# EAGLE design Temperature Card (EAGLE 6.4)

## Sheet 1 of 2
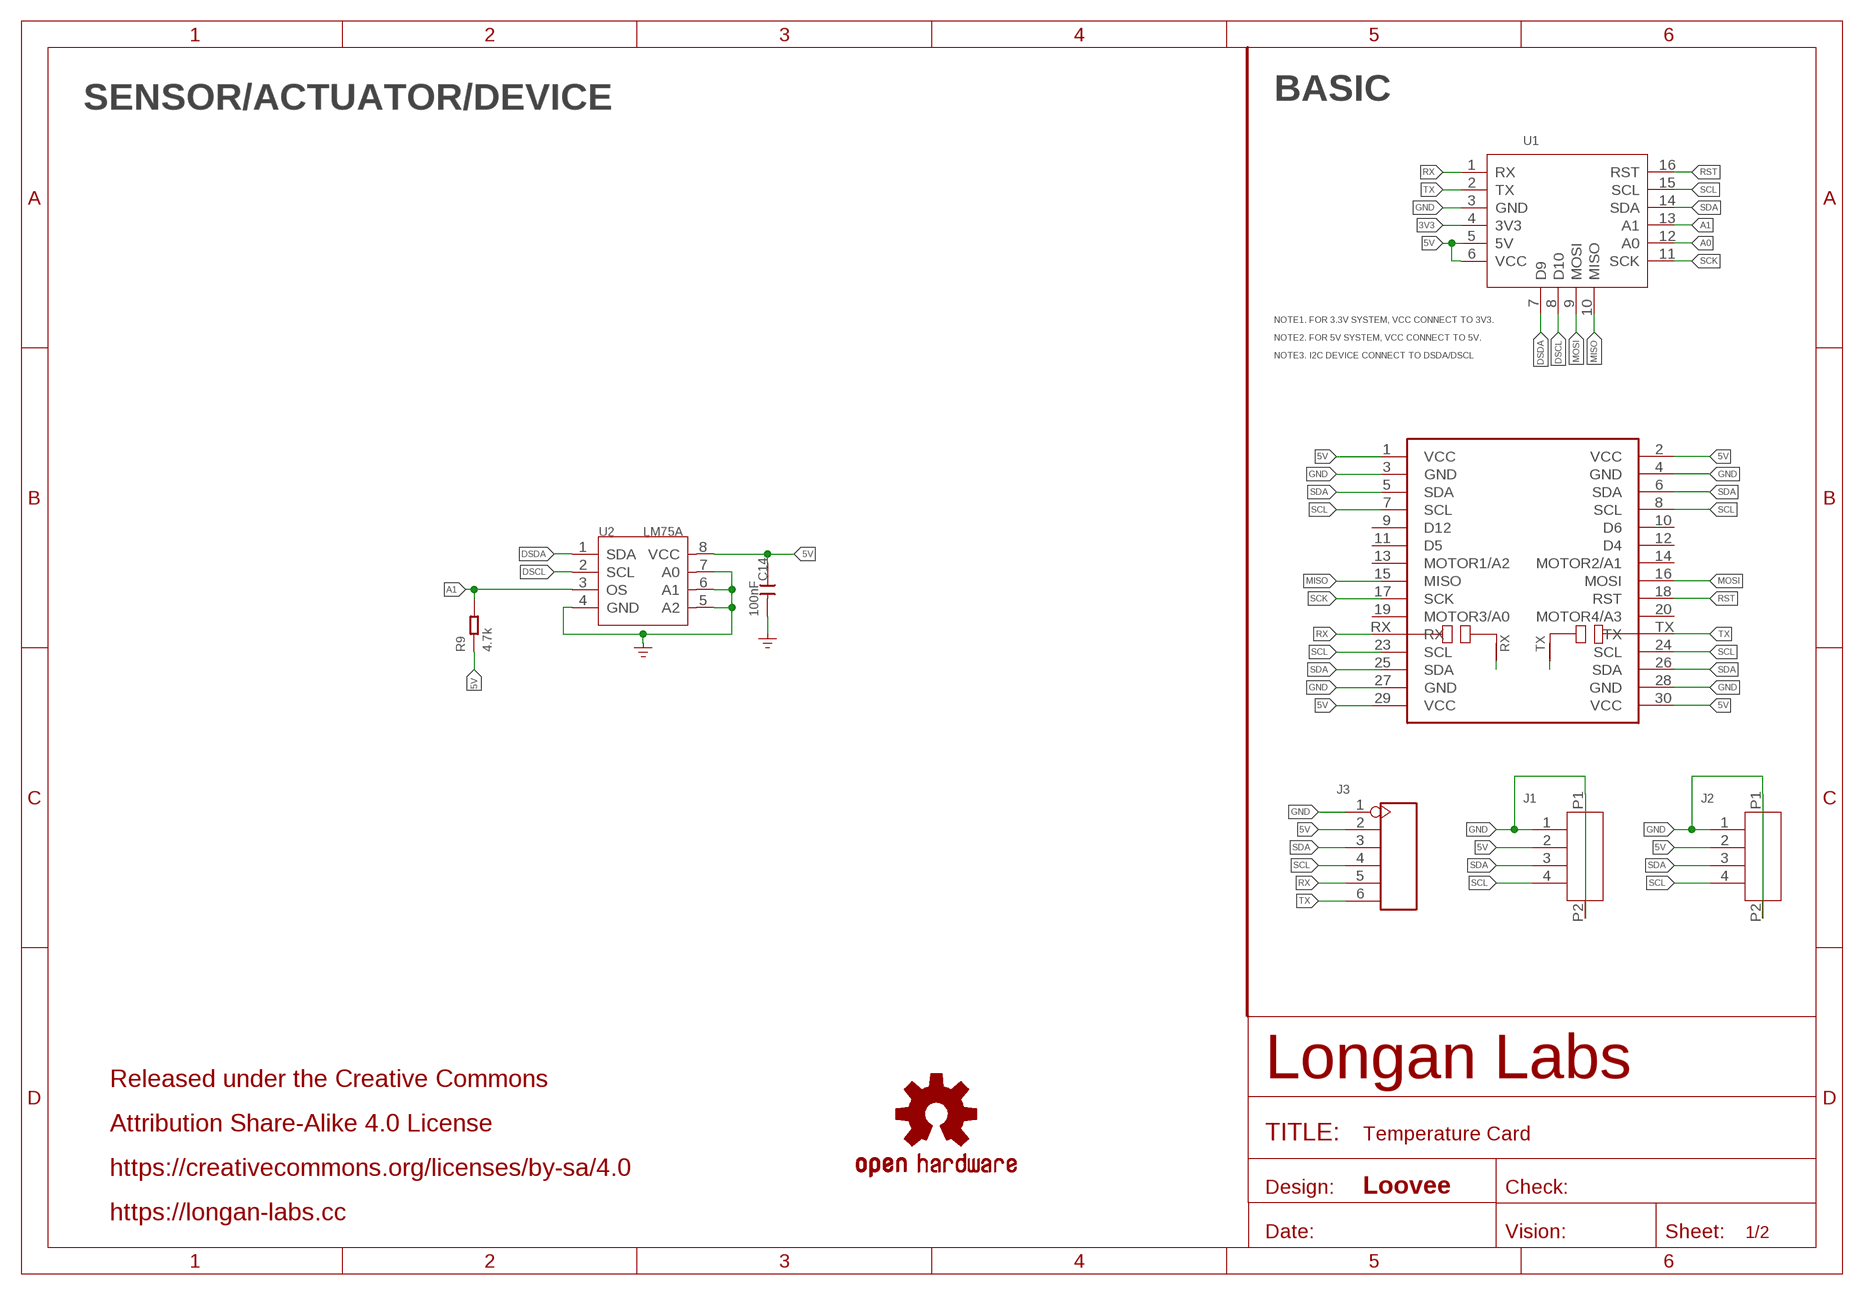
[diagram p0: schematic, sheet 1]

### Parts
C14  100nF  CAP-0603  [C0603]
J1  HEADER-4P-1.0  [4P-1.0-90D]
J2  HEADER-4P-1.0  [4P-1.0-90D]
J3  HEADER-6P-55/35MIL  [H6-2.54]
LOGO2  OSHW-LOGOS  [OSHW-LOGO-S]
MOUDLE2  MOUDLE-CARDS-UART'BOARD'  [MOUDLE-2X15P-UART]
R9  4.7k  RES-0603  [R0603]
U1  MOUDLE-CARDS  [16P-2.0-CARDS]
U2  LM75A  SENSOR-LM75A  [TSSOP8-0.65-3X3MM]

### Nets
3V3: U1.4(3V3)
5V: C14.1 J1.2 J2.2 J3.2 MOUDLE2.1(VCC) MOUDLE2.2(VCC) MOUDLE2.29(VCC) MOUDLE2.30(VCC) R9.1 U1.5(5V) U1.6(VCC) U2.8(VCC)
A0: U1.12(A0)
A1: R9.2 U1.13(A1) U2.3(OS)
DSCL: U1.8(D10) U2.2(SCL)
DSDA: U1.7(D9) U2.1(SDA)
GND: C14.2 J1.1 J1.P1 J1.P2 J2.1 J2.P1 J2.P2 J3.1 MOUDLE2.3(GND) MOUDLE2.4(GND) MOUDLE2.27(GND) MOUDLE2.28(GND) U1.3(GND) U2.4(GND) U2.5(A2) U2.6(A1) U2.7(A0) ; supply symbol labelled GND_POWER
MISO: MOUDLE2.15(MISO) U1.10(MISO)
MOSI: MOUDLE2.16(MOSI) U1.9(MOSI)
N$1: MOUDLE2.RX/N1(RX/N) MOUDLE2.RX/N2(RX/N)
N$2: MOUDLE2.TX/N1(TX/N) MOUDLE2.TX/N2(TX/N)
RST: MOUDLE2.18(RST) U1.16(RST)
RX: J3.5 MOUDLE2.RX U1.1(RX)
SCK: MOUDLE2.17(SCK) U1.11(SCK)
SCL: J1.4 J2.4 J3.4 MOUDLE2.7(SCL) MOUDLE2.8(SCL) MOUDLE2.23(SCL) MOUDLE2.24(SCL) U1.15(SCL)
SDA: J1.3 J2.3 J3.3 MOUDLE2.5(SDA) MOUDLE2.6(SDA) MOUDLE2.25(SDA) MOUDLE2.26(SDA) U1.14(SDA)
TX: J3.6 MOUDLE2.TX U1.2(TX)
Unconnected: MOUDLE2.9(D12) MOUDLE2.10(D6) MOUDLE2.11(D5) MOUDLE2.12(D4) MOUDLE2.13(MOTOR1/A2) MOUDLE2.14(MOTOR2/A1) MOUDLE2.19(MOTOR3/A0) MOUDLE2.20(MOTOR4/A3)

### Notes on the sheet
- SENSOR/ACTUATOR/DEVICE | BASIC
- NOTE1. FOR 3.3V SYSTEM, VCC CONNECT TO 3V3.
- NOTE2. FOR 5V SYSTEM, VCC CONNECT TO 5V.
- NOTE3. I2C DEVICE CONNECT TO DSDA/DSCL
- Released under the Creative Commons
- Attribution Share-Alike 4.0 License
- https://creativecommons.org/licenses/by-sa/4.0
- Loovee
- https://longan-labs.cc

## Sheet 2 of 2

## Library data of the parts
C14 = Discrete-new:CAP: Ceramic Capacitors
J1 J2 = Longan-Connect:HEADER-4P-1.0
J3 = Connector-new:HEADER-6P
LOGO2 = SparkFun-Aesthetics:OSHW-LOGO: Open-Source Hardware (OSHW) Logo This logo indicates the piece of hardware it is found on incorporates a OSHW license and/or adheres to the definition of open source hardware found here: http://freedomdefined.org/OSHW
MOUDLE2 = Longan-moudle:MOUDLE-CARDS-UART
R9 = Discrete-new:RES
U1 = MOUDLE-CARDS:MOUDLE-CARDS
U2 = Discrete-new:SENSOR-LM75A: E314010005

## Board
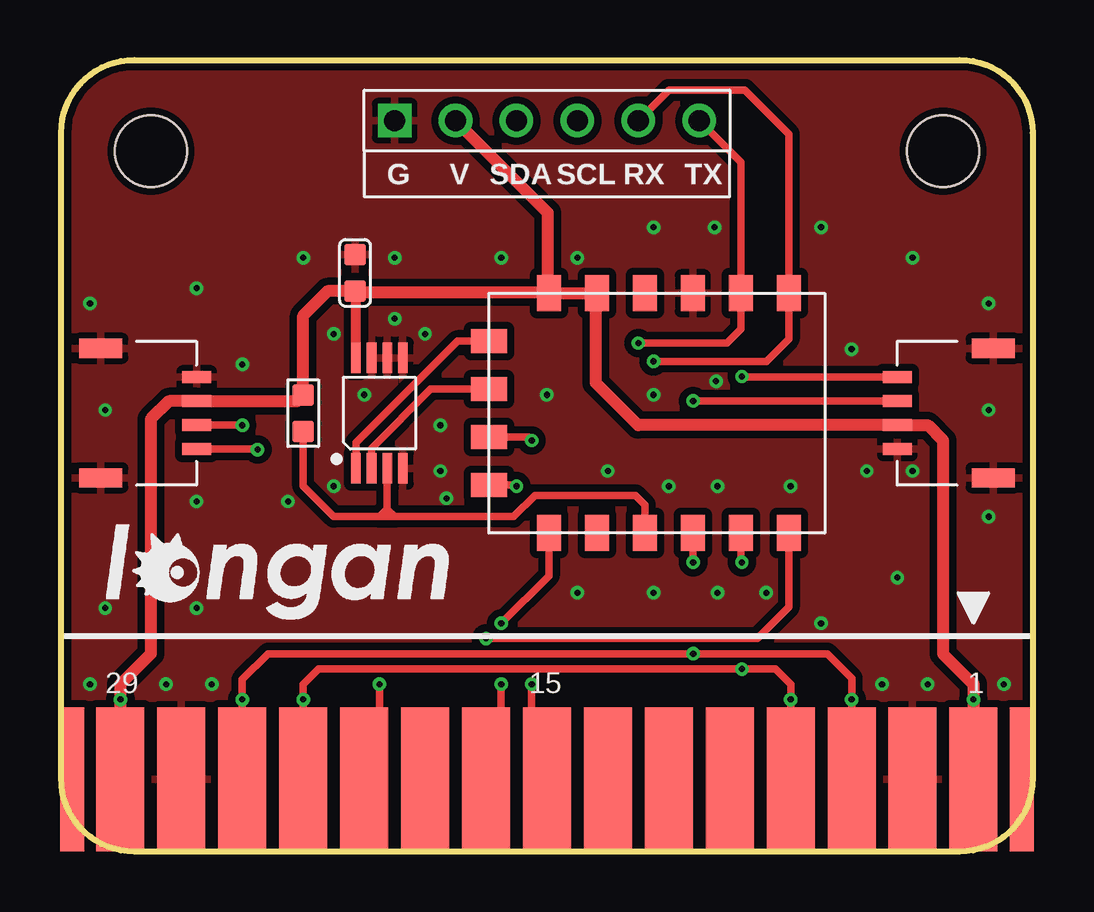
[diagram p1: board, top side]
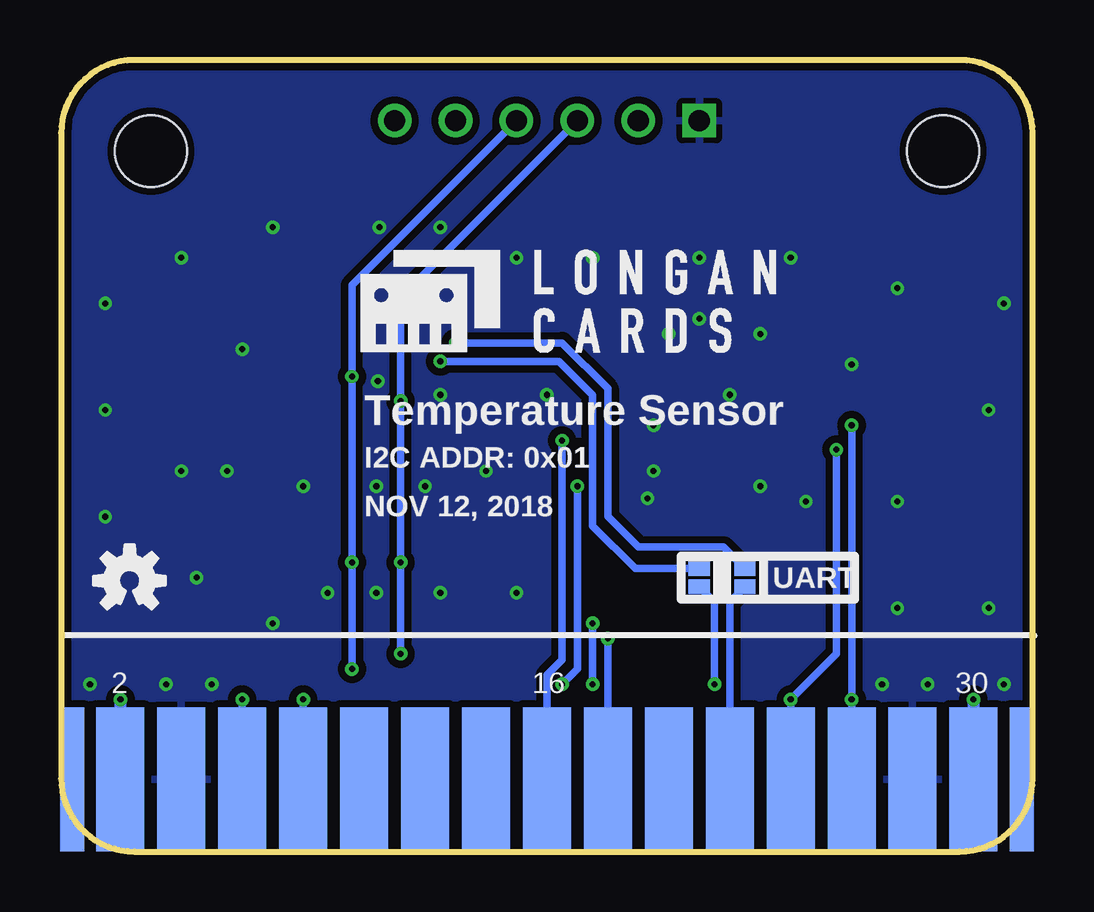
[diagram p2: board, bottom side, seen from below]

Size 40.5 x 33 mm. Coordinates in mm from the lower left corner, seen from the top.
Copper layers (1*16): Top 0.035mm / dielectric 1.5mm / Bottom 0.035mm
Design rules "SeeedStudio_2layer_DRU_no_angle_20140221 *": minimum track width 6mil, minimum drill 10mil, track to track 6mil, track to pad 6mil, pad to pad 6mil, via to via 6mil, smd to smd 0mil, copper to edge 10mil, drill to drill 10mil, minimum pad ring 10mil, minimum via ring 6mil, stop-mask expansion 2mil, vias tented up to drill 25mil, thermal gap 10mil

### Footprints (pad centres in the part's own frame; a part is rotated, then mirrored left to right if it is on the bottom)
C0603 = smd 0.889 x 0.889: 1 0,0.762; 2 0,-0.762
4P-1.0-90D = smd 1.2 x 0.5: 1 0,1.5; 2 0,0.5; 3 0,-0.5; 4 0,-1.5 | smd 1.8 x 0.8: P1 -4,2.7; P2 -4,-2.7
H6-2.54 = drill 0.889 pad 1.397 square: 1 0,6.35 | drill 0.889 pad 1.397: 2 0,3.81; 3 0,1.27; 4 0,-1.27; 5 0,-3.81; 6 0,-6.35
MOUDLE-2X15P-UART = smd 2 x 6: 1 17.78,-13.492; 3 15.24,-13.492; 5 12.7,-13.492; 7 10.16,-13.492; 9 7.62,-13.492; 11 5.08,-13.492; 13 2.54,-13.492; 15 0,-13.492; 17 -2.54,-13.492; 19 -5.08,-13.492; 23 -10.16,-13.492; 25 -12.7,-13.492; 27 -15.24,-13.492; 29 -17.78,-13.492; RX/N2 -7.62,-13.492 | smd 2 x 6 bottom: 2 17.78,-13.492; 4 15.24,-13.492; 6 12.7,-13.492; 8 10.16,-13.492; 10 7.62,-13.492; 12 5.08,-13.492; 14 2.54,-13.492; 16 0,-13.492; 18 -2.54,-13.492; 20 -5.08,-13.492; 24 -10.16,-13.492; 26 -12.7,-13.492; 28 -15.24,-13.492; 30 -17.78,-13.492; TX/N2 -7.62,-13.492 | smd 1 x 6: P1 -19.8,-13.492; P4 19.8,-13.492 | smd 1 x 6 bottom: P2 -19.8,-13.492; P3 19.8,-13.492 | smd 0.889 x 0.61 bottom: RX -6.35,-4.699; RX/N1 -6.35,-5.461; TX -8.255,-4.699; TX/N1 -8.255,-5.461 | hole 3: -16.51,12.7; 16.51,12.7
R0603 = smd 0.889 x 0.889: 1 0,0.762; 2 0,-0.762
16P-2.0-CARDS = smd 1.5 x 1: 1 -5,5; 2 -5,3; 3 -5,1; 4 -5,-1; 5 -5,-3; 6 -5,-5; 11 5,-5; 12 5,-3; 13 5,-1; 14 5,1; 15 5,3; 16 5,5 | smd 1 x 1.5: 7 -3,-7.5; 8 -1,-7.5; 9 1,-7.5; 10 3,-7.5
TSSOP8-0.65-3X3MM = smd 0.4 x 1.27: 1 -0.975,-2.3; 2 -0.325,-2.3; 3 0.325,-2.3; 4 0.975,-2.3; 5 0.975,2.3; 6 0.325,2.3; 7 -0.325,2.3; 8 -0.975,2.3

### Placement (x,y rotation side)
C14  12.25,24.12 180 top
J1  5.64,18.28 0 top
J2  34.86,18.28 180 top
J3  20.25,30.47 90 top
LOGO2  37.65,11.29 0 bottom
MOUDLE2  20.25,16.5 0 top
R9  10.09,18.28 0 top
U1  25.33,18.28 270 top
U2  13.27,18.28 0 top
U$1  [LONGAN-CARDS-MIDDLE]  28.76,20.31 0 bottom
U$2  [LONGAN-SILK-SMALLER]  0.57,8.5 0 top

### Tracks (layer width: path | path; a pad name or v marks a point on that pad's centre or on a via)
5V  (via drill 0.25 pad 0.51)
  Top 0.406: U2.8 12.29,23.32 C14.1
  Top 0.508: 12.29,23.32 20.29,23.32 | 20.29,23.32 U1.6 U1.5 22.28,23.23 22.28,19.55 24.05,17.78 J2.2 36.12,17.78 36.76,17.14 36.76,8.24 38.03,6.97 v38.03,6.34 MOUDLE2.2 | C14.1 11.11,23.36 10.09,22.34 R9.1 9.83,18.78 J1.2 4.49,18.78 3.74,18.02 3.74,8.24 2.47,6.97 v2.47,6.34 MOUDLE2.30 | 20.29,23.32 20.29,26.62 J3.2
  Bottom 0.508: v2.47,6.34 MOUDLE2.30 | v38.03,6.34 MOUDLE2.2
A1
  Top 0.305: 13.27,13.96 11.36,13.96 10.09,15.23 R9.2 | U2.3 13.59,14.29 | 13.59,14.27 13.59,14.03 13.52,13.96 | U1.13 24.33,14.45 23.93,14.85 19.74,14.85 18.85,13.96 13.9,13.96 | 13.9,13.96 13.77,13.96 13.52,13.96 | 13.59,14.29 13.59,14.27 | 13.59,14.27 13.9,13.96 | 13.59,14.29 13.27,13.96 | 13.27,13.96 13.52,13.96
DSCL
  Top 0.305: U1.8 15.41,19.28 12.94,16.81 U2.2
DSDA
  Top 0.305: U2.1 12.29,17.05 16.52,21.28 U1.7
GND  (via drill 0.25 pad 0.51)
  other vias: 15.8,15.87 15.8,17.77 12.63,19.04 13.9,22.21 15.17,21.58 20.25,19.04 24.7,19.04 27.3,19.61 25.33,15.23 22.79,15.87 27.36,15.23 30.41,15.23 29.39,10.79 27.36,10.79 24.7,10.79 21.52,10.79 31.68,9.52 38.66,18.41 32.95,20.95 38.66,22.85 38.66,13.96 35.49,15.87 33.59,15.87 34.22,6.97 36.12,6.97 39.3,6.97 4.38,6.97 6.28,6.97 1.2,6.97 5.64,10.15 1.84,10.15 9.46,14.6 5.64,14.6 11.36,15.23 11.36,21.58 7.55,20.31 1.84,18.41 1.2,22.85 10.09,24.76 13.9,24.76 18.34,24.76 21.52,24.76 24.7,26.02 27.23,26.02 31.68,26.02 35.49,24.76 34.86,11.42 16.06,14.72 5.64,23.48
  pour Top (isolate 0.305): -0.07,32.88 40.7,32.88 40.7,-0.01 -0.07,-0.01
  pour Bottom (isolate 0.305): -0.07,32.88 40.7,32.88 40.7,-0.01 -0.07,-0.01
MISO  (via drill 0.25 pad 0.51)
  Top 0.305: U1.10 18.93,15.28 v18.98,15.23 | v19.61,6.97 19.61,3.64 MOUDLE2.15
  Bottom 0.305: v18.98,15.23 18.98,7.61 v19.61,6.97
MOSI  (via drill 0.25 pad 0.51)
  Top 0.305: U1.9 19.47,17.28 v19.61,17.14
  Bottom 0.305: v19.61,17.14 19.61,7.99 20.25,7.36 MOUDLE2.16
N$1  (via drill 0.25 pad 0.51)
  Top 0.305: MOUDLE2.RX/N2 12.63,3.8 13.27,4.44 v13.27,6.97
  Bottom 0.305: v13.27,6.97 13.27,10.4 MOUDLE2.RX/N1
N$2
  Bottom 0.305: MOUDLE2.TX/N2 12.63,10.4 MOUDLE2.TX/N1
RST  (via drill 0.25 pad 0.51)
  Top 0.305: U1.16 30.33,10.2 29.01,8.88 v17.71,8.88
  Bottom 0.305: v17.71,8.88 MOUDLE2.18
RX  (via drill 0.25 pad 0.51)
  Top 0.305: J3.5 25.33,31.74 28.51,31.74 30.33,29.91 U1.1 30.33,21.37 29.39,20.44 v24.7,20.44
  Bottom 0.305: v24.7,20.44 19.74,20.44 18.34,19.04 18.34,13.58 16.57,11.8 MOUDLE2.RX
SCK  (via drill 0.25 pad 0.51)
  Top 0.305: v18.34,6.97 18.34,3.64 MOUDLE2.17 | U1.11 20.33,11.5 v18.34,9.52
  Bottom 0.305: v18.34,9.52 v18.34,6.97
SCL  (via drill 0.25 pad 0.51)
  Top 0.305: U1.15 28.33,12.1 v28.38,12.05 | J2.4 28.4,19.78 v28.38,19.8 | J1.4 8.16,16.78 v8.19,16.75 | MOUDLE2.23 v10.09,6.34 10.09,6.97 10.72,7.61 v28.38,7.61 29.77,7.61 30.41,6.97 v30.41,6.34 MOUDLE2.8
  Bottom 0.305: v28.38,7.61 v28.38,12.05 v28.38,19.8 28.38,23.61 J3.4 | v8.19,16.75 8.19,8.24 v10.09,6.34 MOUDLE2.23 | v30.41,6.34 MOUDLE2.8
SDA  (via drill 0.25 pad 0.51)
  Top 0.305: U1.14 26.33,12.07 v26.35,12.05 | J2.3 26.35,18.78 v26.35,18.79 | J1.3 v7.54,17.78 v7.55,17.77 | MOUDLE2.25 v7.55,6.34 7.55,7.17 8.63,8.24 v26.35,8.24 31.93,8.24 32.95,7.23 v32.95,6.34 MOUDLE2.6
  Bottom 0.305: J3.3 26.35,23.1 v26.35,18.79 v26.35,12.05 v26.35,8.24 | v7.55,17.77 v7.55,6.34 MOUDLE2.25 | v32.95,6.34 MOUDLE2.6
TX  (via drill 0.25 pad 0.51)
  Top 0.305: J3.6 28.33,28.74 U1.2 28.33,21.79 27.74,21.2 v24.06,21.2
  Bottom 0.305: v24.06,21.2 19.61,21.2 17.71,19.29 17.71,13.96 16.44,12.69 12.88,12.69 MOUDLE2.TX

### Text on the board
tPlace: G | V | SDA | SCL | RX | TX
bPlace: Temperature Sensor | I2C ADDR: 0x01 | NOV 12, 2018